# EAGLE design Si_FET_Adapter (EAGLE 9.6.2)
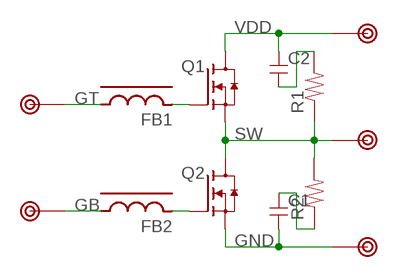
[diagram p0: schematic, sheet 1]

## Parts
C1  C-3225-2  [3225-2]
C2  C-3225-2  [3225-2]
FB1  FB-1608FB  [1608-FB]
FB2  FB-1608FB  [1608-FB]
Q1  NMOS-DFN  [DFN5_5X6]
Q2  NMOS-DFN  [DFN5_5X6]
R1  R-2012-2  [2012-2]
R2  R-2012-2  [2012-2]
TP1  TESTPIN  [TESTPIN]
TP2  TESTPIN-MID  [TESTPIN-MID]
TP3  TESTPIN-MID  [TESTPIN-MID]
TP4  TESTPIN-MID  [TESTPIN-MID]
TP5  TESTPIN-MID  [TESTPIN-MID]

## Nets
GB: FB2.1 TP4.1
GND: C1.2 Q2.1(S) Q2.2(S) Q2.3(S) TP3.1
GT: FB1.1 TP5.1
N$1: C2.2 R1.2
N$2: C1.1 R2.1
N$3: FB1.2 Q1.4(G)
N$4: FB2.2 Q2.4(G)
SW: Q1.1(S) Q1.2(S) Q1.3(S) Q2.5_6(D) Q2.5_6_1(D) Q2.5_6_2(D) Q2.5_6_3(D) Q2.5_6_4(D) R1.1 R2.2 TP2.1
VDD: C2.1 Q1.5_6(D) Q1.5_6_1(D) Q1.5_6_2(D) Q1.5_6_3(D) Q1.5_6_4(D) TP1.1

## Library data of the parts
C1 C2 = my_rcl:C
FB1 FB2 = my_rcl:FB
Q1 Q2 = my_ic:NMOS
R1 R2 = my_rcl:R
TP1-TP5 = my_connector:TESTPIN

## Board
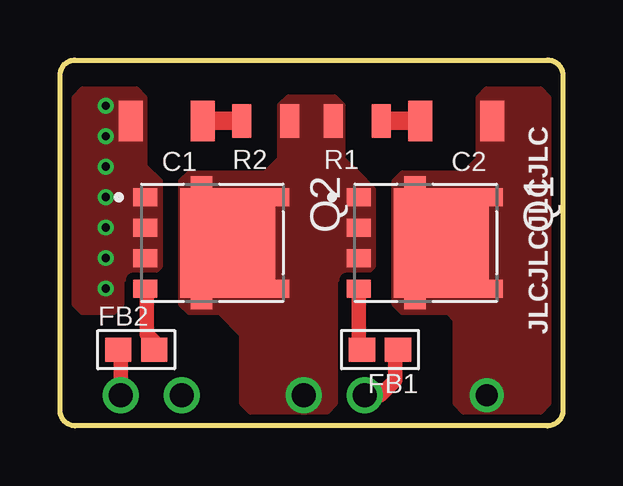
[diagram p1: board, top side]
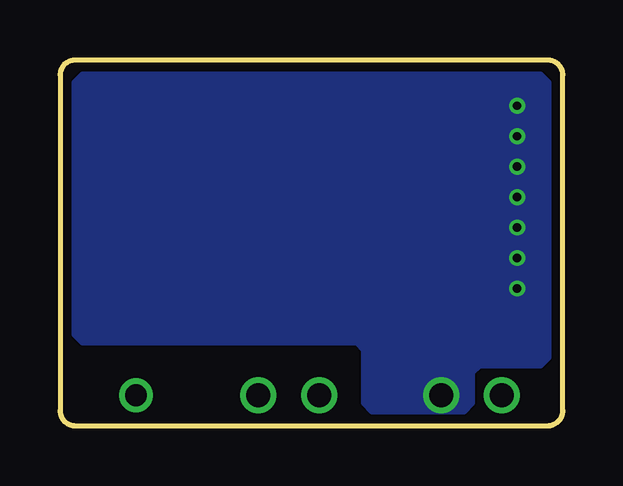
[diagram p2: board, bottom side, seen from below]

Size 20.95 x 15.24 mm. Coordinates in mm from the lower left corner, seen from the top.
Outline: 0,0.64 0,14.61 arc-90 0.64,15.24 20.32,15.24 arc-90 20.95,14.61 20.95,0.64 arc-90 20.32,0 0.64,0 arc-90 0,0.64
Copper layers (1*16): Top 0.035mm / dielectric 1.5mm / Bottom 0.035mm
Design rules "SeeedStudio_2layer_DRU_20140221": minimum track width 6mil, minimum drill 0.3mm, track to track 8mil, track to pad 8mil, pad to pad 8mil, via to via 12mil, smd to smd 0mil, copper to edge 0.3mm, drill to drill 10mil, minimum pad ring 0.15mm, minimum via ring 6mil, stop-mask expansion 2mil, vias tented up to drill 1mm, thermal gap 10mil

### Footprints (pad centres in the part's own frame; a part is rotated, then mirrored left to right if it is on the bottom)
3225-2 = smd 1 x 1.7: 1 -1.5,0; 2 1.5,0
1608-FB = smd 1.1 x 1: 1 -0.75,0; 2 0.75,0
DFN5_5X6 = smd 0.75 x 1: 1 1.905,2.795; 2 0.635,2.795; 3 -0.635,2.795; 4 -1.905,2.795 | smd 4.56 x 3.955: 5_6 0,-0.647 | smd 0.495 x 0.905: 5_6_1 2.527,0.453; 5_6_2 -2.527,0.453 | smd 0.75 x 0.575: 5_6_3 -1.905,-2.913; 5_6_4 1.905,-2.913
2012-2 = smd 0.8 x 1.4: 1 -1,0; 2 1,0
TESTPIN = drill 0.9 pad 1.4: 1 0,0
TESTPIN-MID = drill 1 pad 1.3: 1 0,0

### Placement (x,y rotation side)
C1  4.45,12.7 180 top
C2  16.51,12.7 180 top
FB1  13.34,3.17 180 top
FB2  3.17,3.17 0 top
Q1  15.24,7.62 90 top
Q2  6.35,7.62 90 top
R1  12.38,12.7 0 top
R2  8.57,12.7 0 top
TP1  17.78,1.27 0 top
TP2  10.16,1.27 0 top
TP3  5.08,1.27 0 top
TP4  2.54,1.27 0 top
TP5  12.7,1.27 0 top

### Tracks (layer width: path | path; a pad name or v marks a point on that pad's centre or on a via)
GB
  Top 0.61: FB2.1 2.54,3.06 TP4.1
GND  (via drill 0.35)
  other vias: 1.91,5.71 1.91,6.99 1.91,8.26 1.91,9.53 1.91,10.79 1.91,12.06 1.91,13.34
  pour Top (isolate 0.305, no thermals): 0.95,10.48 3.81,10.48 4.13,10.16 4.13,6.67 3.81,6.35 2.86,6.35 2.54,6.03 2.54,5.08 2.22,4.76 0.95,4.76 0.64,5.08 0.64,10.16
  pour Top (isolate 0.305, no thermals): 0.64,10.16 4.13,10.16 3.49,10.79 3.49,13.65 3.17,13.97 0.95,13.97 0.64,13.65
  pour Bottom (isolate 0.305, no thermals): 4.13,0.64 3.81,0.95 3.81,2.22 3.49,2.54 0.95,2.54 0.64,2.86 0.64,14.29 0.95,14.61 20,14.61 20.32,14.29 20.32,3.81 20,3.49 8.57,3.49 8.26,3.17 8.26,0.95 7.94,0.64
GT
  Top 0.61: TP5.1 13.34,1.27 13.97,1.91 13.97,3.06 FB1.1
N$1
  Top 0.762: R1.2 C2.2
N$2
  Top 0.762: R2.1 C1.1
N$3
  Top 0.61: FB1.2 12.45,3.31 Q1.4
N$4
  Top 0.61: FB2.2 3.92,3.49 3.61,3.81 3.61,5.66 Q2.4
SW
  pour Top (isolate 0.305, no thermals): 7.94,0.64 11.11,0.64 11.43,0.95 11.43,6.03 11.75,6.35 12.7,6.35 13.02,6.67 13.02,9.84 12.38,10.48 5.4,10.48 5.08,10.16 5.08,5.08 5.4,4.76 6.67,4.76 7.62,3.81 7.62,0.95
  pour Top (isolate 0.305, no thermals): 8.57,10.48 12.38,10.48 11.75,11.11 11.75,13.34 11.43,13.65 9.53,13.65 9.21,13.34 9.21,11.11
VDD
  pour Top (isolate 0.305, no thermals): 16.83,0.64 16.51,0.95 16.51,4.45 16.19,4.76 14.29,4.76 13.97,5.08 13.97,10.16 14.29,10.48 20,10.48 20.32,10.16 20.32,0.95 20,0.64
  pour Top (isolate 0.305, no thermals): 16.51,10.16 20.32,10.16 20.32,13.65 20,13.97 17.78,13.97 17.46,13.65 17.46,11.11

### Text on the board
tPlace: JLCJLCJLCJLC